# EAGLE design Navitron (EAGLE 9.6.1)
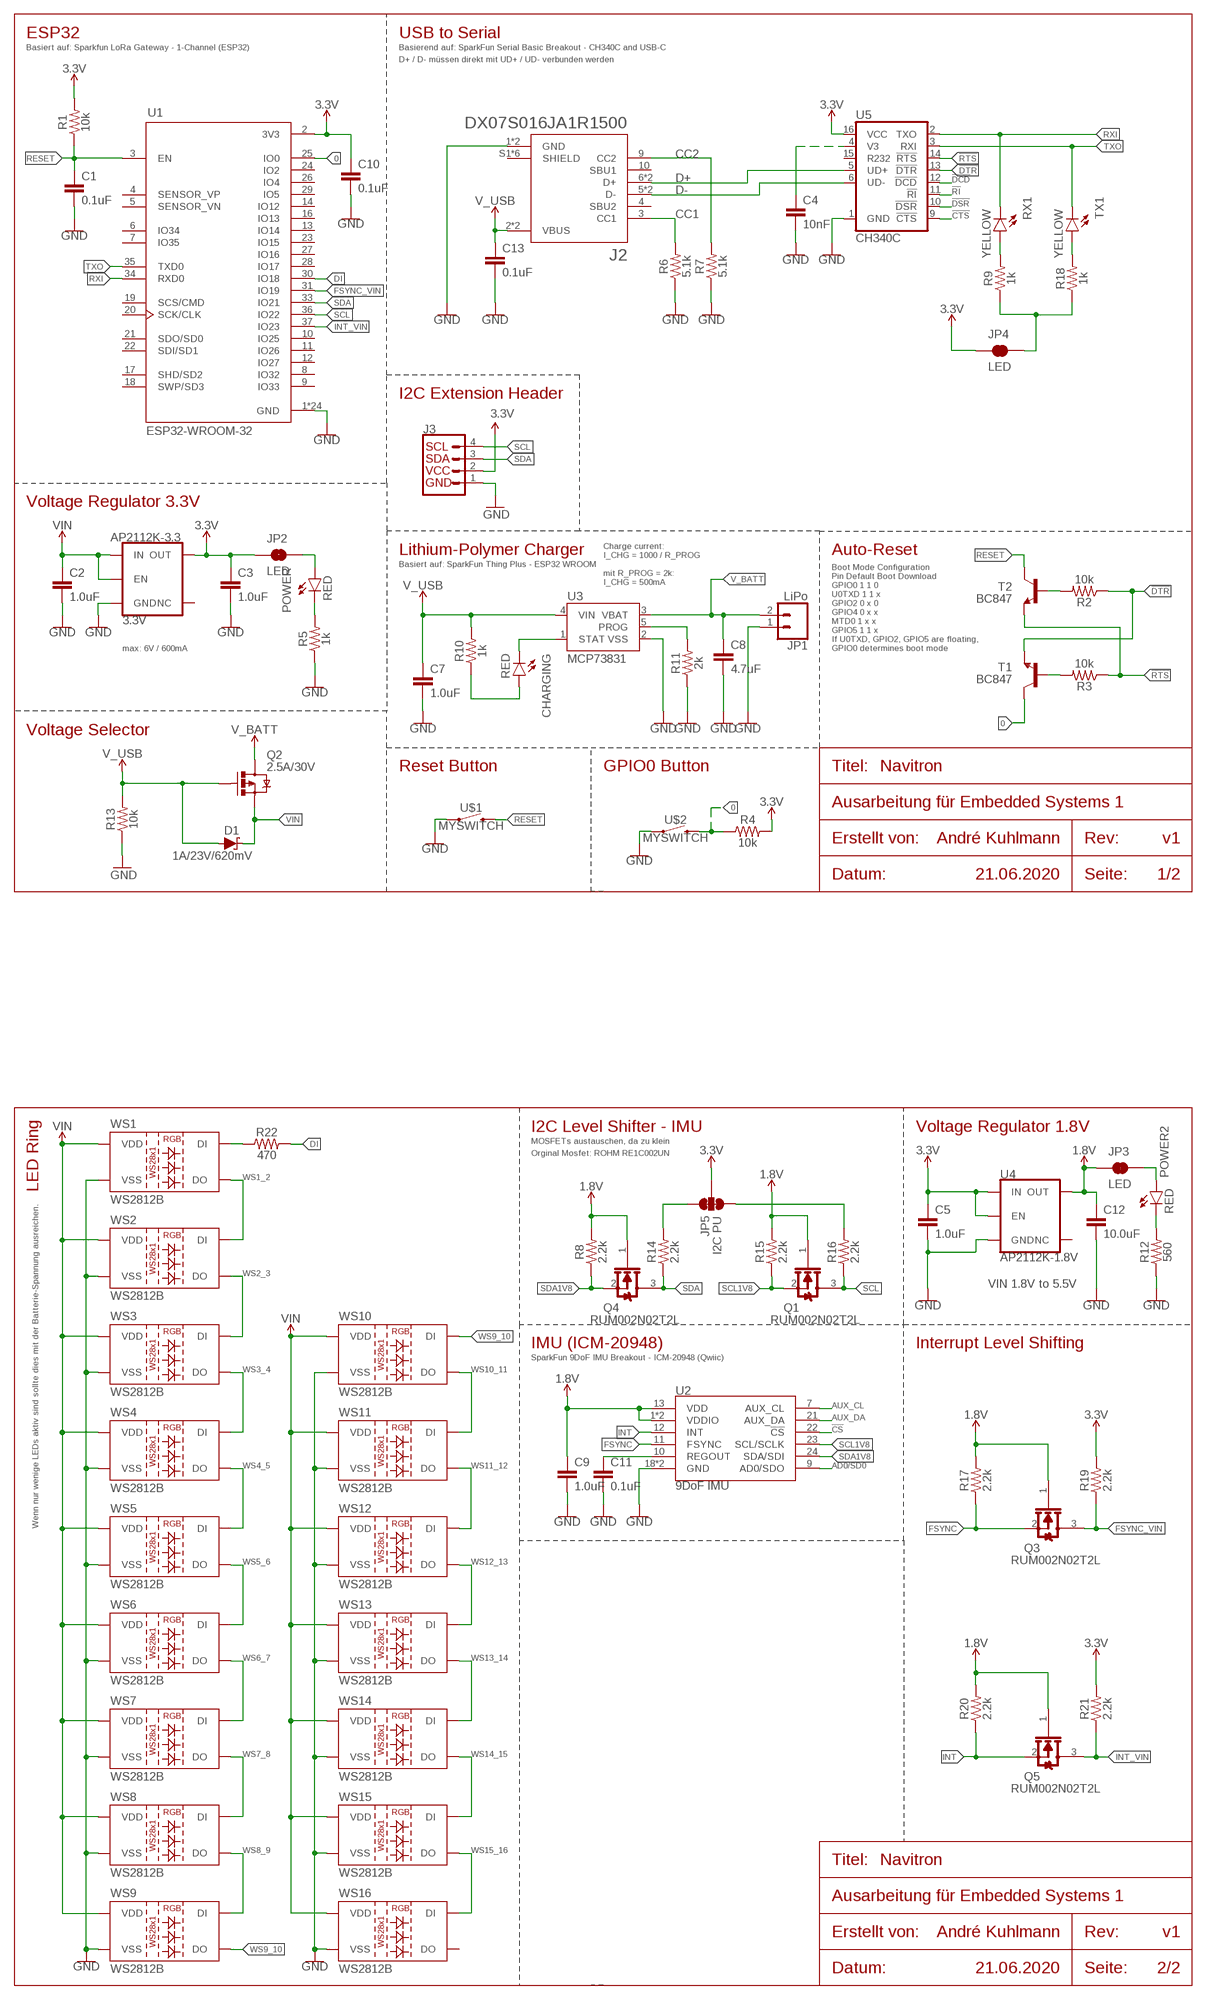
[diagram p0: schematic, sheet 1]

## Parts
AP2112K-3.3  3.3V  V_REG_AP2112K-3.3V  [SOT23-5]
C1  0.1uF  0.1UF-0603-25V-(+80/-20%)  [0603]
C2  1.0uF  0.1UF-0603-25V-(+80/-20%)  [0603]
C3  1.0uF  0.1UF-0603-25V-(+80/-20%)  [0603]
C4  10nF  0.1UF-0603-25V-(+80/-20%)  [0603]
C5  1.0uF  0.1UF-0603-25V-(+80/-20%)  [0603]
C7  1.0uF  0.1UF-0603-25V-(+80/-20%)  [0603]
C8  4.7uF  0.1UF-0603-25V-(+80/-20%)  [0603]
C9  1.0uF  0.1UF-0603-25V-(+80/-20%)  [0603]
C10  0.1uF  0.1UF-0603-25V-(+80/-20%)  [0603]
C11  0.1uF  0.1UF-0603-25V-(+80/-20%)  [0603]
C12  10.0uF  0.1UF-0603-25V-(+80/-20%)  [0603]
C13  0.1uF  0.1UF-0603-25V-(+80/-20%)  [0603]
CHARGING  RED  LED-RED0603  [LED-0603]
D1  1A/23V/620mV  DIODE-SCHOTTKY-BAT20J  [SOD-323]
J2  DX07S016JA1R1500  [JAE_DX07S016JA1R1500]
J3  QWIIC_CONNECTORJS-1MM  [1X04_1MM_RA]
JP1  LiPo  CONN_02-JST-2MM-SMT  [JST-2-SMD]
JP2  LED  JUMPER-SMT_2_NC_TRACE_SILK  [SMT-JUMPER_2_NC_TRACE_SILK]
JP3  LED  JUMPER-SMT_2_NC_TRACE_SILK  [SMT-JUMPER_2_NC_TRACE_SILK]
JP4  LED  JUMPER-SMT_2_NC_TRACE_SILK  [SMT-JUMPER_2_NC_TRACE_SILK]
JP5  I2C PU  JUMPER-SMT_3_2-NC_TRACE_SILK  [SMT-JUMPER_3_2-NC_TRACE_SILK]
POWER  RED  LED-RED0603  [LED-0603]
POWER2  RED  LED-RED0603  [LED-0603]
Q1  ROHM_RUM002N02T2LROHM_RUM002N02T2L_0_0  [ROHM_RUM002N02T2L_0]
Q2  2.5A/30V  MOSFET-PCHANNELDMG2307L  [SOT23-3@1]
Q3  ROHM_RUM002N02T2LROHM_RUM002N02T2L_0_0  [ROHM_RUM002N02T2L_0]
Q4  ROHM_RUM002N02T2LROHM_RUM002N02T2L_0_0  [ROHM_RUM002N02T2L_0]
Q5  ROHM_RUM002N02T2LROHM_RUM002N02T2L_0_0  [ROHM_RUM002N02T2L_0]
R1  10k  10MOHM-0603-1/10W-5%  [0603]
R2  10k  10MOHM-0603-1/10W-5%  [0603]
R3  10k  10MOHM-0603-1/10W-5%  [0603]
R4  10k  10MOHM-0603-1/10W-5%  [0603]
R5  1k  10MOHM-0603-1/10W-5%  [0603]
R6  5.1k  5.1KOHM5.1KOHM-0603-1/10W-1%  [0603]
R7  5.1k  5.1KOHM5.1KOHM-0603-1/10W-1%  [0603]
R8  2.2k  5.1KOHM5.1KOHM-0603-1/10W-1%  [0603]
R9  1k  10MOHM-0603-1/10W-5%  [0603]
R10  1k  5.1KOHM5.1KOHM-0603-1/10W-1%  [0603]
R11  2k  5.1KOHM5.1KOHM-0603-1/10W-1%  [0603]
R12  560  10MOHM-0603-1/10W-5%  [0603]
R13  10k  10MOHM-0603-1/10W-5%  [0603]
R14  2.2k  5.1KOHM5.1KOHM-0603-1/10W-1%  [0603]
R15  2.2k  5.1KOHM5.1KOHM-0603-1/10W-1%  [0603]
R16  2.2k  5.1KOHM5.1KOHM-0603-1/10W-1%  [0603]
R17  2.2k  5.1KOHM5.1KOHM-0603-1/10W-1%  [0603]
R18  1k  10MOHM-0603-1/10W-5%  [0603]
R19  2.2k  5.1KOHM5.1KOHM-0603-1/10W-1%  [0603]
R20  2.2k  5.1KOHM5.1KOHM-0603-1/10W-1%  [0603]
R21  2.2k  5.1KOHM5.1KOHM-0603-1/10W-1%  [0603]
R22  470  5.1KOHM5.1KOHM-0603-1/10W-1%  [0603]
RX1  YELLOW  LED-RED0603  [LED-0603]
T1  BC847  [SOT23]
T2  BC847  [SOT23]
TX1  YELLOW  LED-RED0603  [LED-0603]
U1  ESP32-WROOM-32  [MODULE_ESP32-WROOM-32]
U2  9DoF IMU  MPU-9250  [QFN24-3X3]
U3  MCP73831  [SOT23-5]
U4  AP2112K-1.8V  V_REG_AP2112K-1.8V  [SOT23-5]
U5  CH340C  [SO016]
U$1  MYSWITCH  [MY-BUTTON]
U$2  MYSWITCH  [MY-BUTTON]
WS1  WS2812B  [WS2812B]
WS2  WS2812B  [WS2812B]
WS3  WS2812B  [WS2812B]
WS4  WS2812B  [WS2812B]
WS5  WS2812B  [WS2812B]
WS6  WS2812B  [WS2812B]
WS7  WS2812B  [WS2812B]
WS8  WS2812B  [WS2812B]
WS9  WS2812B  [WS2812B]
WS10  WS2812B  [WS2812B]
WS11  WS2812B  [WS2812B]
WS12  WS2812B  [WS2812B]
WS13  WS2812B  [WS2812B]
WS14  WS2812B  [WS2812B]
WS15  WS2812B  [WS2812B]
WS16  WS2812B  [WS2812B]

## Nets
0: R4.1 T1.3(C) U1.25(IO0) U$2.P$2
1.8V: C9.1 C12.1 JP3.1 Q1.1(GATE) Q3.1(GATE) Q4.1(GATE) Q5.1(GATE) R8.2 R15.2 R17.2 R20.2 U2.1(VDDIO) U2.8(VDDIO) U2.13(VDD) U4.5(OUT)
3.3V: AP2112K-3.3.5(OUT) C3.1 C5.1 C10.1 J3.2 JP2.1 JP4.1 JP5.2 R1.2 R4.2 R19.2 R21.2 U1.2(3V3) U4.1(IN) U4.3(EN) U5.16(VCC)
!CS: U2.22(!CS)
!CTS: U5.9(!CTS)
!DCD: U5.12(!DCD)
!DSR: U5.10(!DSR)
!DTR: R2.1 T1.2(E) U5.13(!DTR)
!RI: U5.11(!RI)
!RTS: R3.1 T2.2(E) U5.14(!RTS)
AD0/SD0: U2.9(AD0/SDO)
AUX_CL: U2.7(AUX_CL)
AUX_DA: U2.21(AUX_DA)
CC1: J2.3(CC1) R6.2
CC2: J2.9(CC2) R7.2
CHAR_LED_VIN: CHARGING.A R10.1
D+: J2.6(D+) J2.7(D+) U5.5(UD+)
D-: J2.5(D-) J2.8(D-) U5.6(UD-)
DI: R22.2 U1.30(IO18)
DI_TO_WS: R22.1 WS1.4(DI)
FSYNC: Q3.2(SOURCE) R17.1 U2.11(FSYNC)
FSYNC_VIN: Q3.3(DRAIN) R19.1 U1.31(IO19)
GND: AP2112K-3.3.2(GND) C1.2 C2.2 C3.2 C4.2 C5.2 C7.2 C8.2 C9.2 C10.2 C11.2 C12.2 C13.2 J2.1(GND) J2.12(GND) J3.1 JP1.1 R5.1 R6.1 R7.1 R11.1 R12.1 R13.1 U1.1(GND) U1.15(GND) U1.38(GND) U1.39_1(GND) U1.39_2(GND) U1.39_3(GND) U1.39_4(GND) U1.39_5(GND) U1.39_6(GND) U1.39_7(GND) U1.39_8(GND) U1.39_9(GND) U1.39_10(GND) U1.39_11(GND) U1.39_12(GND) U1.39_13(GND) U1.39_14(GND) U1.39_15(GND) U1.39_16(GND) U1.39_17(GND) U1.39_18(GND) U1.39_19(GND) U1.39_20(GND) U1.39_21(GND) U2.18(GND) U2.20(GND) U3.2(VSS) U4.2(GND) U5.1(GND) U$1.P$1 U$2.P$1 WS1.3(VSS) WS2.3(VSS) WS3.3(VSS) WS4.3(VSS) WS5.3(VSS) WS6.3(VSS) WS7.3(VSS) WS8.3(VSS) WS9.3(VSS) WS10.3(VSS) WS11.3(VSS) WS12.3(VSS) WS13.3(VSS) WS14.3(VSS) WS15.3(VSS) WS16.3(VSS)
INT: Q5.2(SOURCE) R20.1 U2.12(INT)
INT_VIN: Q5.3(DRAIN) R21.1 U1.37(IO23)
LED1.8: JP3.2 POWER2.A
LED1.8_2: POWER2.C R12.2
N$1: POWER.C R5.2
N$8: JP2.2 POWER.A
PROG: R11.2 U3.5(PROG)
REGOUT: C11.1 U2.10(REGOUT)
RESET: C1.1 R1.1 T2.3(C) U1.3(EN) U$1.P$2
RXI: RX1.C U1.34(RXD0) U5.2(TXO)
SCL: J3.4 Q1.3(DRAIN) R16.1 U1.36(IO22)
SCL1V8: Q1.2(SOURCE) R15.1 U2.23(SCL/SCLK)
SDA: J3.3 Q4.3(DRAIN) R14.1 U1.33(IO21)
SDA1V8: Q4.2(SOURCE) R8.1 U2.24(SDA/SDI)
SDA_W_1: JP5.1 R14.2
SDA_W_2: JP5.3 R16.2
STAT: CHARGING.C U3.1(STAT)
TO_RX_LED: R9.2 RX1.A
TO_T1: R3.2 T1.1(B)
TO_T2: R2.2 T2.1(B)
TO_TX_LED: R18.2 TX1.A
TX_RX_LED_SUPPLY: JP4.2 R9.1 R18.1
TXO: TX1.C U1.35(TXD0) U5.3(RXI)
V3_CH340: C4.1 U5.4(V3)
V_BATT: C8.1 JP1.2 Q2.3(D) U3.3(VBAT)
V_USB: C7.1 C13.1 D1.A J2.2(VBUS) J2.11(VBUS) Q2.1(G) R10.2 R13.2 U3.4(VIN)
VIN: AP2112K-3.3.1(IN) AP2112K-3.3.3(EN) C2.1 D1.C Q2.2(S) WS1.1(VDD) WS2.1(VDD) WS3.1(VDD) WS4.1(VDD) WS5.1(VDD) WS6.1(VDD) WS7.1(VDD) WS8.1(VDD) WS9.1(VDD) WS10.1(VDD) WS11.1(VDD) WS12.1(VDD) WS13.1(VDD) WS14.1(VDD) WS15.1(VDD) WS16.1(VDD)
WS1_2: WS1.2(DO) WS2.4(DI)
WS2_3: WS2.2(DO) WS3.4(DI)
WS3_4: WS3.2(DO) WS4.4(DI)
WS4_5: WS4.2(DO) WS5.4(DI)
WS5_6: WS5.2(DO) WS6.4(DI)
WS6_7: WS6.2(DO) WS7.4(DI)
WS7_8: WS7.2(DO) WS8.4(DI)
WS8_9: WS8.2(DO) WS9.4(DI)
WS9_10: WS9.2(DO) WS10.4(DI)
WS10_11: WS10.2(DO) WS11.4(DI)
WS11_12: WS11.2(DO) WS12.4(DI)
WS12_13: WS12.2(DO) WS13.4(DI)
WS13_14: WS13.2(DO) WS14.4(DI)
WS14_15: WS14.2(DO) WS15.4(DI)
WS15_16: WS15.2(DO) WS16.4(DI)
Unconnected: AP2112K-3.3.4(NC) J2.4(SBU2) J2.10(SBU1) J2.S1(SHIELD) J2.S2(SHIELD) J2.S3(SHIELD) J2.S4(SHIELD) J2.S5(SHIELD) J2.S6(SHIELD) U1.4(SENSOR_VP) U1.5(SENSOR_VN) U1.6(IO34) U1.7(IO35) U1.8(IO32) U1.9(IO33) U1.10(IO25) U1.11(IO26) U1.12(IO27) U1.13(IO14) U1.14(IO12) U1.16(IO13) U1.17(SHD/SD2) U1.18(SWP/SD3) U1.19(SCS/CMD) U1.20(SCK/CLK) U1.21(SDO/SD0) U1.22(SDI/SD1) U1.23(IO15) U1.24(IO2) U1.26(IO4) U1.27(IO16) U1.28(IO17) U1.29(IO5) U4.4(NC) U5.15(R232) WS16.2(DO)

## Notes on the sheet
- ESP32 | USB to Serial
- Basiert auf: Sparkfun LoRa Gateway - 1-Channel (ESP32) | Basierend auf: SparkFun Serial Basic Breakout - CH340C and USB-C
- D+ / D- müssen direkt mit UD+ / UD- verbunden werden
- I2C Extension Header
- Voltage Regulator 3.3V
- Charge current:
  I_CHG = 1000 / R_PROG
  
  mit R_PROG = 2k:
  I_CHG = 500mA
- Lithium-Polymer Charger | Auto-Reset
- Basiert auf: SparkFun Thing Plus - ESP32 WROOM
- max: 6V / 600mA
- Boot Mode Configuration
  Pin Default Boot Download
  GPIO0 1 1 0
  U0TXD 1 1 x
  GPIO2 0 x 0
  GPIO4 0 x x
  MTD0 1 x x
  GPIO5 1 1 x
  If U0TXD, GPIO2, GPIO5 are floating,
  GPIO0 determines boot mode
- Voltage Selector
- Reset Button | GPIO0 Button | Titel: | Navitron
- Ausarbeitung für Embedded Systems 1
- Erstellt von: | André Kuhlmann | Rev: | v1
- Datum: | 21.06.2020 | Seite: | 1/2
- LED Ring | I2C Level Shifter - IMU | Voltage Regulator 1.8V
- MOSFETs austauschen, da zu klein
- Orginal Mosfet: ROHM RE1C002UN
- Wenn nur wenige LEDs aktiv sind sollte dies mit der Batterie-Spannung ausreichen.
- VIN 1.8V to 5.5V
- IMU (ICM-20948) | Interrupt Level Shifting
- SparkFun 9DoF IMU Breakout - ICM-20948 (Qwiic)
- Titel: | Navitron
- Ausarbeitung für Embedded Systems 1
- Erstellt von: | André Kuhlmann | Rev: | v1
- Datum: | 21.06.2020 | Seite: | 2/2

## Library data of the parts
AP2112K-3.3 = SparkFun-IC-Power:V_REG_AP2112: AP2112 - 600mA CMOS LDO Regulator w/ Enable The AP2112 is CMOS process low dropout linear regulator with enable function, the regulator delivers a guaranteed 600mA (min.) continuous load current. Features Output Voltage Accuracy: ±1.5% Output Current: 600mA (Min.) Foldback Short Current Protection: 50mA Enable Function to Turn ON/OFF VOUT Low Dropout Voltage (3.3V): 250mV (Typ.) @IOUT=600mA Excellent Load Regulation: 0.2%/A (Typ.) Excellent Line Regulation: 0.02%/V (Typ.) Low Quiescent Current: 55μA (Typ.) Low Standby Current: 0.01μA (Typ.) Low Output Noise: 50μVRMS PSRR: 100Hz -65dB, 1kHz -65dB OTSD Protection Stable with 1.0μF Flexible Cap: Ceramic, Tantalum and Aluminum Electrolytic Operation Temperature Range: -40°C to 85°C ESD: MM 400V, HBM 4000V; PROD_ID: VREG-12457
C1 C10 C11 C13 = SparkFun-Capacitors:0.1UF: 0.1µF ceramic capacitors A capacitor is a passive two-terminal electrical component used to store electrical energy temporarily in an electric field.; PROD_ID: CAP-00810
C2-C5 C7-C9 C12 = SparkFun-Capacitors:0.1UF: 0.1µF ceramic capacitors A capacitor is a passive two-terminal electrical component used to store electrical energy temporarily in an electric field.; PROD_ID: CAP-00810; VALUE: 0.1uF
CHARGING POWER POWER2 = SparkFun-LED:LED-RED: Red SMD LED Used in manufacturing of most products at SparkFun Packages: 0603 - SMD 0603 package [Product Link] <http://docs.avagotech.com/docs/AV02-0551EN> 0603 SMART - SMD 0603 SMART package ( more efficient and expensive)[Product Link] <http://www.osram-os.com/Graphics/XPic2/00077099_0.pdf> 1206 - SMD1206 package [Product Link] <https://www.sparkfun.com/datasheets/DevTools/LilyPad/Q150OVS4.pdff> SparkFun Products: Pro Mini 328 -5V <https://www.sparkfun.com/products/821> RedBoard <https://www.sparkfun.com/products/12757> IOIO-OTG <https://www.sparkfun.com/products/13613>; PROD_ID: DIO-00819
D1 = SparkFun-DiscreteSemi:DIODE-SCHOTTKY: Schottky diode A Schottky diode is a semiconductor diode which has a low forward voltage drop and a very fast switching action.; PROD_ID: DIO-11623
J2 = USB Type C - DX07S016JA1R1500:DX07S016JA1R1500: USB-C (USB TYPE-C) USB 2.0 Receptacle Connector 24 (16+8 Dummy) Position Surface Mount, Right Angle; Through Hole; DESCRIPTION: USB-C (USB TYPE-C) USB 2.0 Receptacle Connector 24 (16+8 Dummy) Position Surface Mount, Right Angle; Through Hole; DIGI-KEY_PART_NUMBER: 670-DX07S016JA1R1500CT-ND; DIGIKEY-PURCHASE-URL: https://snapeda.com/shop?store=DigiKey&id=4551013; MF: JAE Electronics; MOUSER-PURCHASE-URL: https://snapeda.com/shop?store=Mouser&id=4551013; MP: DX07S016JA1R1500; PACKAGE: None
J3 = SparkFun-Connectors:QWIIC_CONNECTOR: SparkFun I2C Standard Qwiic Connector An SMD 1mm pitch JST connector makes it easy and quick (get it? Qwiic?) to connect I2C devices to each other. The Qwiic system <http://www.sparkfun.com/qwiic> enables fast and solderless connection between popular platforms and various sensors and actuators. We carry 200mm <https://www.sparkfun.com/products/14204>, 100mm <https://www.sparkfun.com/products/14205>, 50mm <https://www.sparkfun.com/products/14206>, and breadboard friendly <https://www.sparkfun.com/products/14207> Qwiic cables. We also offer 10 pcs strips <https://www.sparkfun.com/products/14323> the SMD connectors.; PROD_ID: CONN-13694
JP1 = SparkFun-Connectors:CONN_02: Multi connection point. Often used as Generic Header-pin footprint for 0.1 inch spaced/style header connections On any of the 0.1 inch spaced packages, you can populate with these: Break Away Headers - Straight <https://www.sparkfun.com/products/116> (PRT-00116) Break Away Male Headers - Right Angle <https://www.sparkfun.com/products/553> (PRT-00553) Female Headers <https://www.sparkfun.com/products/115> (PRT-00115) Break Away Headers - Machine Pin <https://www.sparkfun.com/products/117> (PRT-00117) Break Away Female Headers - Swiss Machine Pin <https://www.sparkfun.com/products/743> (PRT-00743) For SCREWTERMINALS and SPRING TERMINALS visit here: Screw Terimnals on SparkFun.com <https://www.sparkfun.com/search/results?term=Screw+Terminals> (5mm/3.5mm/2.54mm spacing) This device is also useful as a general connection point to wire up your design to another part of your project. Our various solder wires solder well into these plated through hole pads. Hook-Up Wire - Assortment (Stranded, 22 AWG) <https://www.sparkfun.com/products/11375> (PRT-11375) Hook-Up Wire - Assortment (Solid Core, 22 AWG) <https://www.sparkfun.com/products/11367> (PRT-11367) View the entire wire category on our website here <https://www.sparkfun.com/categories/141> Special notes: Molex polarized connector foot print use with: PRT-08233 with associated crimp pins and housings. 2.54_SCREWTERM for use with PRT-10571. 3.5mm Screw Terminal footprints for PRT-08084 5mm Screw Terminal footprints for use with PRT-08432; PROD_ID: CONN-11443
JP2-JP4 = SparkFun-Jumpers:JUMPER-SMT_2_NC_TRACE: Normally closed trace jumper This jumper has a trace between two pads so it's normally closed (NC). Use a razor knife to open the connection. For best results follow the IPC guidelines for cutting traces: Cutout at least 0.063 mm (0.005 in). Remove all loose material to clean up the cut area. Seal the cut with an approved epoxy. Reapply solder to reclose the connection.
JP5 = SparkFun-Jumpers:JUMPER-SMT_3_2-NC_TRACE: Normally closed trace jumper (2 of 2 connections) This jumper has a trace between all three pads so they are normally closed (NC). Use a razor knife to open the connection(s). For best results follow the IPC guidelines for cutting traces: Cutout at least 0.063 mm (0.005 in). Remove all loose material to clean up the cut area. Seal the cut with an approved epoxy. Reapply solder to reclose the connection(s).
Q1 Q3-Q5 = ROHM - RUM002N02T2L:ROHM_RUM002N02T2L: Nch 20V 200mA Small Signal MOSFET; CENTROID_NOT_SPECIFIED: No; DATASHEET: http://www.rohm.com/web/global/datasheet/RUM002N02/rum002n02t2l-e; DIGIKEY_DESCRIPTION: TRANS MOSFET N-CH 20V 0.2A VMT3; DIGIKEY_PART_NUMBER: RUM002N02T2LCT-ND; IMPORTED_FROM: octopart; IPC_LAND_PATTERN_NAME: SOT95P280X160-3; LEAD_FREE: yes; MF: ROHM; MOUSER_PART_NUMBER: 755-RUM002N02T2L; MPN: RUM002N02T2L; PACKAGE: SOT-23; PREFIX: Q; ROHS: yes; TEMPERATURE_RANGE_HIGH: +150°C; TEMPERATURE_RANGE_LOW: -55°C
Q2 = SparkFun-DiscreteSemi:MOSFET-PCHANNEL: Generic PMOSFET IRLML2244 - TRANS-11153 (SOT-23 -20V -4.3A) (1.Gate 2.Source 3.Drain) FQP27P06 - COM-10349 <http://www.sparkfun.com/products/10349> (TO-220 -60V -27A) (1.Gate 2.Source 3.Drain); PROD_ID: TRANS-11308
R1-R5 R9 R12 R13 R18 = SparkFun-Resistors:10MOHM: RES-09327; PROD_ID: RES-08283; VALUE: 10M
R6 R7 = SparkFun-Resistors:5.1KOHM; PROD_ID: RES-12083
R8 R10 R11 R14-R17 R19-R22 = SparkFun-Resistors:5.1KOHM; PROD_ID: RES-12083; VALUE: 5.1k
RX1 TX1 = SparkFun-LED:LED-RED: Red SMD LED Used in manufacturing of most products at SparkFun Packages: 0603 - SMD 0603 package [Product Link] <http://docs.avagotech.com/docs/AV02-0551EN> 0603 SMART - SMD 0603 SMART package ( more efficient and expensive)[Product Link] <http://www.osram-os.com/Graphics/XPic2/00077099_0.pdf> 1206 - SMD1206 package [Product Link] <https://www.sparkfun.com/datasheets/DevTools/LilyPad/Q150OVS4.pdff> SparkFun Products: Pro Mini 328 -5V <https://www.sparkfun.com/products/821> RedBoard <https://www.sparkfun.com/products/12757> IOIO-OTG <https://www.sparkfun.com/products/13613>; PROD_ID: DIO-00819; VALUE: RED
T1 T2 = transistor:BC847: NPN TRANSISTOR
U1 = ESP32-WROOM-32:ESP32-WROOM-32: Bluetooth, WiFi Transceiver Module 2.4GHz ~ 2.5GHz Surface Mount; AVAILABILITY: Unavailable; DESCRIPTION: Bluetooth, WiFi Transceiver Module 2.4GHz ~ 2.5GHz Surface Mount; DIGIKEY-PURCHASE-URL: https://snapeda.com/shop?store=DigiKey&id=2753322; MF: Espressif Systems; MP: ESP32-WROOM-32; PACKAGE: Module Espressif Systems; PRICE: None
U2 = SparkFun-Sensors:MPU-9250: MPU-9250 9 Degree of Freedom IMU System in Package that contains MPU-6500 & AK8963 NC pin 19. 2-6 & 14-17 not internally connected. May be used for PCB trace routing. Datasheet <https://cdn.sparkfun.com/assets/learn_tutorials/5/5/0/MPU9250REV1.0.pdf> SparkFun Products: SparkFun 9DoF Razor IMU M0 <https://www.sparkfun.com/products/14001> SparkFun IMU Breakout - MPU-9250 <https://www.sparkfun.com/products/13762>; PROD_ID: IC-13192
U3 = SparkFun-PowerIC:MCP73831: Miniature single cell, fully integrated Li-Ion, Li-polymer charge management controller http://ww1.microchip.com/downloads/en/DeviceDoc/20001984g.pdf IC-09995; PROD_ID: IC-09995
U4 = SparkFun-IC-Power-Customized:V_REG_AP2112: AP2112 - 600mA CMOS LDO Regulator w/ Enable The AP2112 is CMOS process low dropout linear regulator with enable function, the regulator delivers a guaranteed 600mA (min.) continuous load current. Features Output Voltage Accuracy: ±1.5% Output Current: 600mA (Min.) Foldback Short Current Protection: 50mA Enable Function to Turn ON/OFF VOUT Low Dropout Voltage (3.3V): 250mV (Typ.) @IOUT=600mA Excellent Load Regulation: 0.2%/A (Typ.) Excellent Line Regulation: 0.02%/V (Typ.) Low Quiescent Current: 55μA (Typ.) Low Standby Current: 0.01μA (Typ.) Low Output Noise: 50μVRMS PSRR: 100Hz -65dB, 1kHz -65dB OTSD Protection Stable with 1.0μF Flexible Cap: Ceramic, Tantalum and Aluminum Electrolytic Operation Temperature Range: -40°C to 85°C ESD: MM 400V, HBM 4000V
U5 = SparkFun-IC-Comms:CH340C; PROD_ID: IC-14038
U$1 U$2 = MyLib:MYSWITCH
WS1-WS16 = SparkFun-LED:WS2812B: WS2812B SMD addressable RGB LED 5x5mm SMD LED with built-in controller IC. Color: Red/Green/Blue mC Rating: RGB: 390, 660, 180 mcd Forward Voltage: RGB: 2.0, 3.0, 3.0 V Packages:WS2812B SparkFun Products: Blynk Board - ESP8266 <https://www.sparkfun.com/products/13794>; PROD_ID: DIO-12503

## Net classes
1 power: width 0.178 mm

## Board
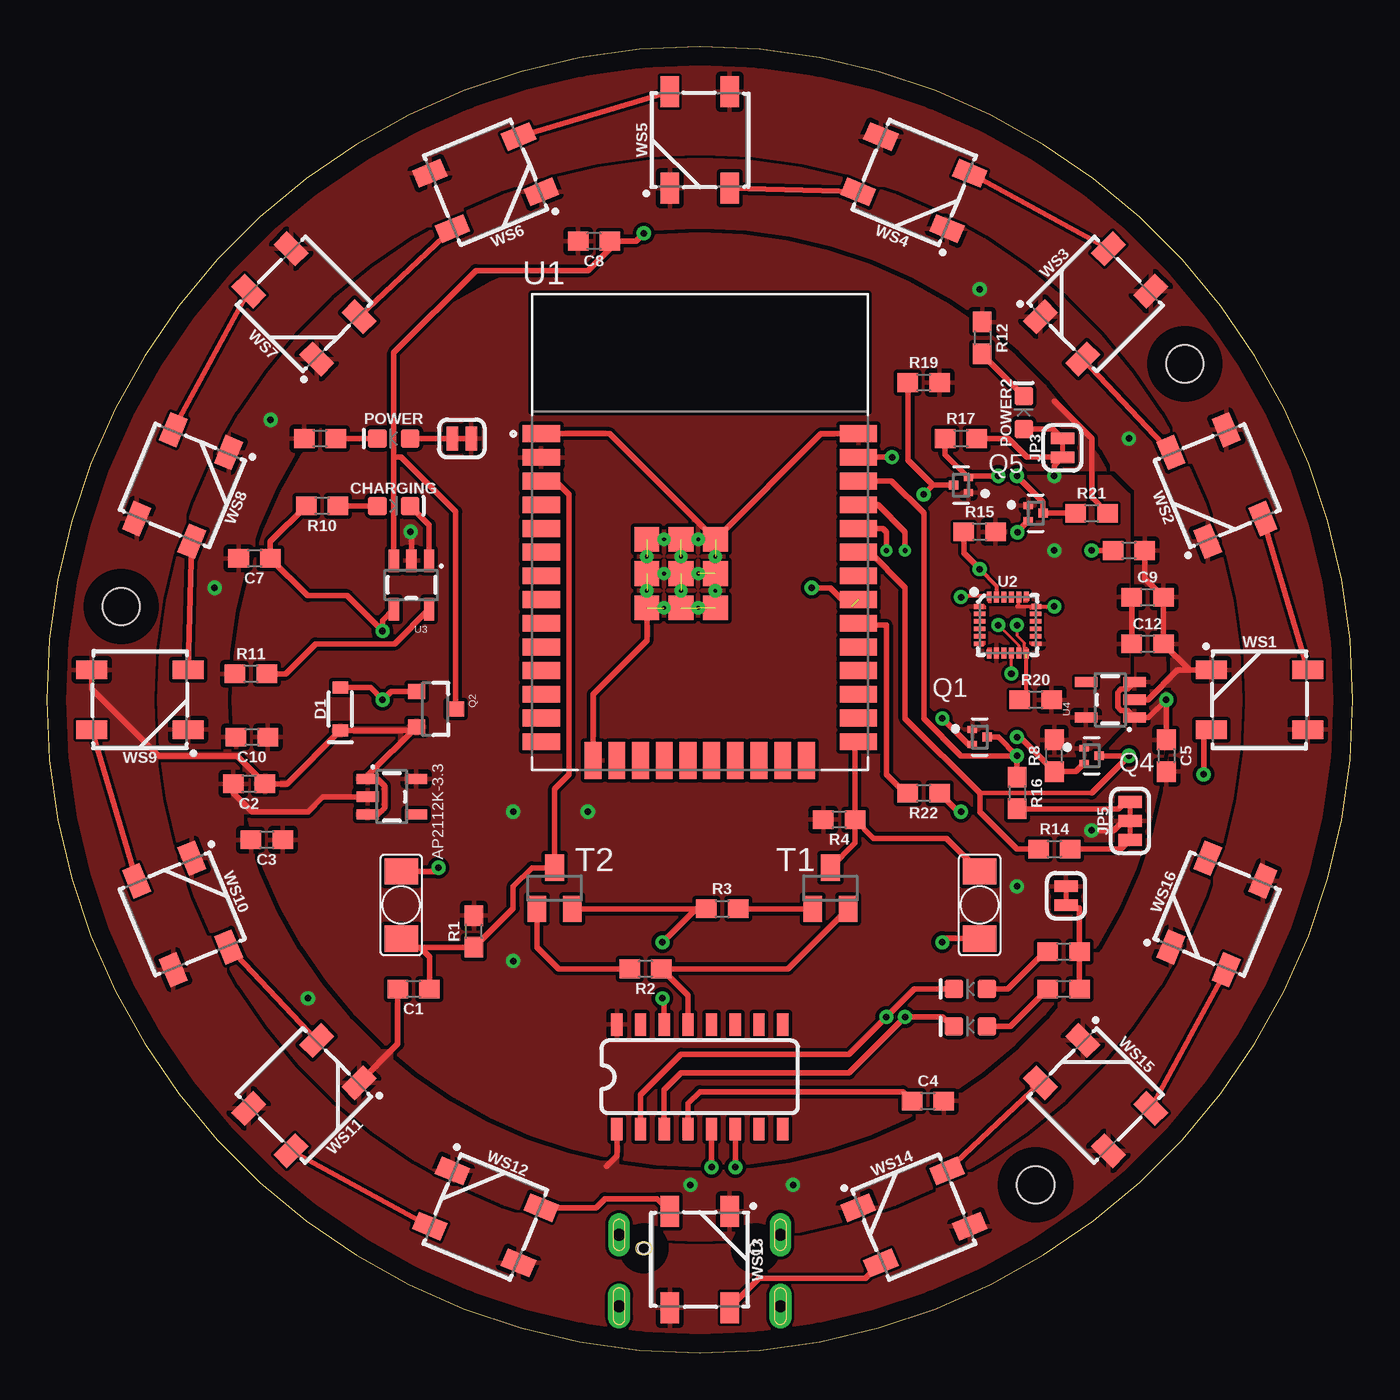
[diagram p1: board, top side]
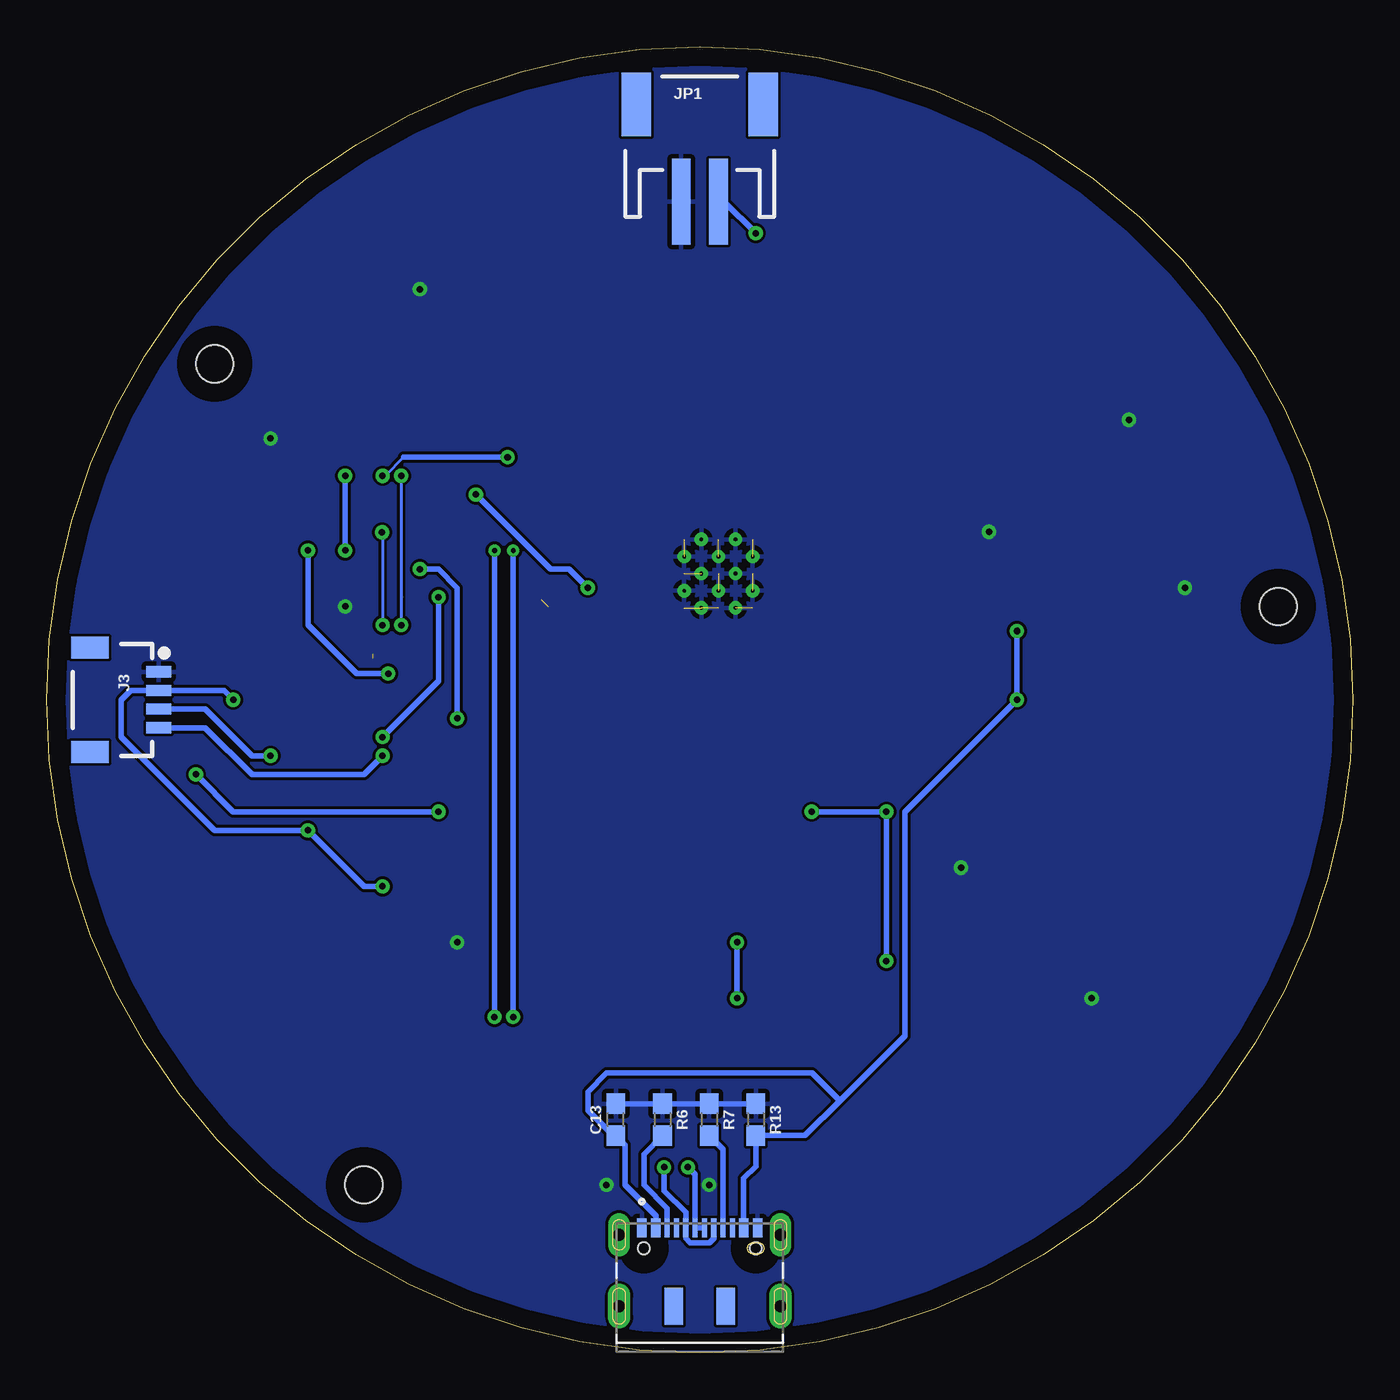
[diagram p2: board, bottom side, seen from below]

Size 70 x 70 mm. Coordinates in mm from the lower left corner, seen from the top.
Outline: 0,35 arc90 35,0 arc90 70,35 arc90 35,70
Outline: 35,70 arc90 0,35
Outline: 35,70 arc90 0,35
Copper layers (1*16): Top 0.035mm / dielectric 0.15mm / Bottom 0.035mm
Design rules "default": minimum track width 6mil, minimum drill 0.35mm, track to track 6mil, track to pad 6mil, pad to pad 6mil, via to via 6mil, smd to smd 6mil, copper to edge 40mil, drill to drill 6mil, minimum pad ring 10mil, minimum via ring 8mil, stop-mask expansion 4mil, vias tented up to drill 0mil, thermal gap 10mil
Holes 2 mm at 4,40 61,53 53,9

### Footprints (pad centres in the part's own frame; a part is rotated, then mirrored left to right if it is on the bottom)
SOT23-5 = smd 0.55 x 1.2: 1 -0.95,-1.3; 2 0,-1.3; 3 0.95,-1.3; 4 0.95,1.3; 5 -0.95,1.3
0603 = smd 1.1 x 1: 1 -0.85,0; 2 0.85,0
LED-0603 = smd 1 x 1: A -0.877,0; C 0.877,0
SOD-323 = smd 0.63 x 0.83: A 1.15,0; C -1.15,0
JAE_DX07S016JA1R1500 = smd 0.52 x 1: 1 -3.1,1.1; 2 -2.35,1.1; 11 2.35,1.1; 12 3.1,1.1 | smd 0.27 x 1: 3 -1.75,1.1; 4 -1.25,1.1; 5 -0.75,1.1; 6 -0.25,1.1; 7 0.25,1.1; 8 0.75,1.1; 9 1.25,1.1; 10 1.75,1.1 | smd 1 x 2: S1 -1.4,-3.1; S2 1.4,-3.1 | drill 0.65 long: S3 -4.32,0.725; S4 4.32,0.725 | drill 0.65 pad 1.2 long: S5 -4.32,-3.1; S6 4.32,-3.1 | hole 0.6: 3,0 | hole 0.63: 3,0; -3,0
1X04_1MM_RA = smd 0.6 x 1.35: 1 -1.5,0; 2 -0.5,0; 3 0.5,0; 4 1.5,0 | smd 1.2 x 2: NC1 2.8,-3.675; NC2 -2.8,-3.675
JST-2-SMD = smd 1 x 4.6: 1 -1,-3.7; 2 1,-3.7 | smd 1.6 x 3.4: NC1 -3.4,1.5; NC2 3.4,1.5
SMT-JUMPER_2_NC_TRACE_SILK = smd 0.635 x 1.27: 1 -0.508,0; 2 0.508,0
SMT-JUMPER_3_2-NC_TRACE_SILK = smd 0.635 x 1.27: 1 -1.016,0; 2 0,0; 3 1.016,0
ROHM_RUM002N02T2L_0 = smd 0.5 x 0.37: 1 -0.4,0.4; 2 -0.4,-0.4 | smd 0.5 x 0.47: 3 0.4,0
SOT23-3@1 = smd 0.8 x 0.9: 1 -0.95,-1; 2 0.95,-1; 3 0,1.1
SOT23 = smd 1 x 1.4: 1 -0.95,-1.1; 2 0.95,-1.1; 3 0,1.1
MODULE_ESP32-WROOM-32 = smd 2 x 0.9: 1 -8.5,5.26; 2 -8.5,3.99; 3 -8.5,2.72; 4 -8.5,1.45; 5 -8.5,0.18; 6 -8.5,-1.09; 7 -8.5,-2.36; 8 -8.5,-3.63; 9 -8.5,-4.9; 10 -8.5,-6.17; 11 -8.5,-7.44; 12 -8.5,-8.71; 13 -8.5,-9.98; 14 -8.5,-11.25; 25 8.5,-11.25; 26 8.5,-9.98; 27 8.5,-8.71; 28 8.5,-7.44; 29 8.5,-6.17; 30 8.5,-4.9; 31 8.5,-3.63; 32 8.5,-2.36; 33 8.5,-1.09; 34 8.5,0.18; 35 8.5,1.45; 36 8.5,2.72; 37 8.5,3.99; 38 8.5,5.26 | smd 0.9 x 2: 15 -5.715,-12.25; 16 -4.445,-12.25; 17 -3.175,-12.25; 18 -1.905,-12.25; 19 -0.635,-12.25; 20 0.635,-12.25; 21 1.905,-12.25; 22 3.175,-12.25; 23 4.445,-12.25; 24 5.715,-12.25 | smd 1.33 x 1.33: 39_1 -2.835,-0.405; 39_2 -1,-0.405; 39_3 0.835,-0.405; 39_4 -2.835,-2.24; 39_5 -1,-2.24; 39_6 0.835,-2.24; 39_7 -2.835,-4.075; 39_8 -1,-4.075; 39_9 0.835,-4.075 | drill 0.2 pad 0.3: 39_10 -1.917,-0.405; 39_11 -0.083,-0.405; 39_12 -2.835,-1.323; 39_13 -1,-1.323; 39_14 0.835,-1.323; 39_15 -1.917,-2.24; 39_16 -0.083,-2.24; 39_17 -2.835,-3.158; 39_18 -1,-3.158; 39_19 0.835,-3.158; 39_20 -1.917,-4.075; 39_21 -0.083,-4.075
QFN24-3X3 = smd 0.495 x 0.25: 1 -1.552,1; 6 -1.552,-1; 13 1.552,-1; 18 1.552,1 | smd 0.6 x 0.25: 2 -1.5,0.6; 3 -1.5,0.2; 4 -1.5,-0.2; 5 -1.5,-0.6; 14 1.5,-0.6; 15 1.5,-0.2; 16 1.5,0.2; 17 1.5,0.6 | smd 0.25 x 0.495: 7 -1,-1.552; 12 1,-1.552; 19 1,1.552; 24 -1,1.552 | smd 0.25 x 0.6: 8 -0.6,-1.5; 9 -0.2,-1.5; 10 0.2,-1.5; 11 0.6,-1.5; 20 0.6,1.5; 21 0.2,1.5; 22 -0.2,1.5; 23 -0.6,1.5
SO016 = smd 0.6 x 1.2: 1 -4.445,-2.8; 2 -3.175,-2.8; 3 -1.905,-2.8; 4 -0.635,-2.8; 5 0.635,-2.8; 6 1.905,-2.8; 7 3.175,-2.8; 8 4.445,-2.8; 9 4.445,2.8; 10 3.175,2.8; 11 1.905,2.8; 12 0.635,2.8; 13 -0.635,2.8; 14 -1.905,2.8; 15 -3.175,2.8; 16 -4.445,2.8
MY-BUTTON = smd 1.4 x 1.8: P$1 -1.8,0; P$2 1.8,0
WS2812B = smd 1.651 x 1: 1 2.577,-1.6; 2 2.577,1.6; 3 -2.577,1.6; 4 -2.577,-1.6

### Placement (x,y rotation side)
AP2112K-3.3  18.5,29.8 270 top
C1  19.66,19.5 180 top
C2  10.85,30.5 180 top
C3  11.8,27.5 180 top
C4  47.23,13.5 0 top
C5  60,32 270 top
C7  11.14,42.58 180 top
C8  29.33,59.58 180 top
C9  59,40.5 0 top
C10  11,33 180 top
C11  58,43 0 top
C12  59,38 0 top
C13  39.5,12.5 90 bottom
CHARGING  18.6,45.39 0 top
D1  15.74,34.5 90 top
J2  35,5.6 0 bottom
J3  64,35 270 bottom
JP1  35,65.4 0 bottom
JP2  22.25,49 180 top
JP3  54.44,48.5 90 top
JP4  54.63,24.5 270 top
JP5  58.06,28.5 90 top
POWER  18.6,49 180 top
POWER2  52.36,50.39 90 top
Q1  50,33 0 top
Q2  20.82,34.5 270 top
Q3  49,46.5 180 top
Q4  56,32 0 top
Q5  53,45 0 top
R1  22.9,22.58 90 top
R2  32.09,20.58 180 top
R3  36.2,23.8 0 top
R4  42.47,28.58 180 top
R5  14.66,49 0 top
R6  37,12.5 270 bottom
R7  34.5,12.5 270 bottom
R8  54,32 90 top
R9  54.5,21.5 180 top
R10  14.76,45.39 180 top
R11  10.95,36.39 0 top
R12  50.14,54.39 270 top
R13  32,12.5 270 bottom
R14  54,27 0 top
R15  50,44 0 top
R16  52,30 270 top
R17  49,49 0 top
R18  54.5,19.5 180 top
R19  47,52 0 top
R20  53,35 0 top
R21  56,45 0 top
R22  47,30 180 top
RX1  49.5,19.5 180 top
T1  42,24.9 0 top
T2  27.22,24.9 0 top
TX1  49.5,17.5 180 top
U1  35,44 0 top
U2  51.5,39 0 top
U3  19.55,41.15 180 top
U4  57,35 90 top
U5  35,14.8 0 top
U$1  19,24 270 top
U$2  50,24 90 top
WS1  65,35 0 top
WS2  62.72,46.48 112.5 top
WS3  56.21,56.21 45 top
WS4  46.48,62.72 157.5 top
WS5  35,65 90 top
WS6  23.52,62.72 202.5 top
WS7  13.79,56.21 135 top
WS8  7.28,46.48 247.5 top
WS9  5,35 180 top
WS10  7.28,23.52 292.5 top
WS11  13.79,13.79 225 top
WS12  23.52,7.28 337.5 top
WS13  35,5 270 top
WS14  46.48,7.28 22.5 top
WS15  56.21,13.79 315 top
WS16  62.72,23.52 67.5 top

### Tracks (layer width: path | path; a pad name or v marks a point on that pad's centre or on a via)
0
  Top 0.305: T1.3 43.32,27.32 R4.1 | R4.1 44.32,27.58 48.22,27.58 U$2.P$2 | R4.1 43.32,32.57 U1.25
1.8V  (via drill 0.35)
  Top 0.152: 54.19,47.99 JP3.1 | 51.2,44 R15.2
  Top 0.2: 54,35.15 R20.2
  Top 0.305: R17.2 51.53,49 52.54,47.99 JP3.1 54,47.55 v54,47 | C9.1 C12.1
  Bottom 0.305: v54,47 v54,43
  pour Top: 49,47 57,47 58,46 58,34 56,32 50,32 47,35 47,45
3.3V  (via drill 0.35)
  Top 0.305: v60,35 59.85,34.85 | R21.2 56,45.85 56,49 54,51 | v56,28 57.19,28 57.69,28.5 JP5.2 | v60,35 59.05,34.05 U4.1 57.93,34.42 57.57,34.42 57.4,34.6 57.4,35.4 57.57,35.58 57.93,35.58 U4.3 | C5.1 v60,35
  Bottom 0.305: 64.5,35.5 J3.2 | J3.2 60.5,35.5 v60,35 | v25,21 v25,29 v29,29 | v52,25 53,25 v56,28 61,28 66,33 66,35 65.5,35.5 J3.2
  pour Top (isolate 0.2, rank 2): 35,10 arc-90 10,35 arc-90 35,60 arc-90 60,35 arc-90
!DTR
  Top 0.305: U5.13 34.37,19.16 R2.1 39.73,20.58 T1.2
!RTS  (via drill 0.35)
  Top 0.305: T2.2 34.8,23.8 | R3.1 35,23.8 34.8,23.8 | U5.14 33.09,18.91 v33,19 | v33,22 34.8,23.8
  Bottom 0.305: v33,19 v33,22
CC1
  Bottom 0.305: J2.3 36.75,7.75 38,9 38,10.65 R6.2
CC2
  Bottom 0.305: J2.9 33.75,10.9 R7.2
CHAR_LED_VIN
  Top 0.305: CHARGING.A R10.1
D+  (via drill 0.35)
  Top 0.305: U5.5 v35.63,9.94
  Bottom 0.305: v35.63,9.94 35.25,9.56 J2.6 J2.7
D-  (via drill 0.35)
  Top 0.305: U5.6 v36.91,9.94
  Bottom 0.305: v36.91,9.94 36.91,8.67 35.75,7.52 J2.5 35.75,6.13 35.51,5.89 34.49,5.89 34.25,6.13 J2.8
DI
  Top 0.305: U1.30 43.6,39 45,39 45,31 46,30 R22.2
DI_TO_WS  (via drill 0.35)
  Top 0.305: R22.1 48.85,29 v49,29 | v62,31 62,32.98 WS1.4
  Bottom 0.305: v49,29 60,29 v62,31
FSYNC  (via drill 0.35)
  Top 0.152: Q3.2 49.5,47 | v51,39 52.1,37.9 U2.11
  Top 0.305: Q3.2 48.15,48.15 R17.1 | 49.5,47 v51,47
  Bottom 0.152: v51,47 v51,39
FSYNC_VIN  (via drill 0.35)  (1 unrouted)
  Top 0.152: 43,40 43.13,40
  Top 0.305: Q3.3 47.5,46.5 | 47.5,46.5 v47,46 | v41,41 42,41 42.63,40.37 U1.31 | R19.1 46.15,47.85 47.5,46.5
  Bottom 0.305: v47,46 43,42 42,42 v41,41
GND  (via drill 0.35)  (9 unrouted)
  Top 0.2: U2.18 52,40 52,40.02 52.08,40.09 52.08,40.48 U2.20
  Top 0.203: U2.18 v54,40
  Top 0.305: AP2112K-3.3.2 14.8,29.8 14,29 11,29 10,30 C2.2 | WS11.3 18.81,16.55 C1.2 | U1.1 30.17,49.26 U1.39_3 41.5,49.26 U1.38 | U1.39_7 32.16,38.16 29.29,35.28 U1.15 | U3.2 19.55,43.55 v19.5,44 | 61.25,36.6 60.6,36.6 59,35 U4.2 | 61.25,36.6 C12.2 C9.2 58.85,41.5 C11.2 | 61.25,36.6 WS1.3 | 59.83,30.8 C5.2 | U$1.P$1 20.8,25.8 v21,26 | U$2.P$1 48.2,22.2 v48,22 | U5.1 30.55,10.55 30,10
  Bottom 0.305: C13.2 R6.1 R7.1 R13.1
  other vias: 9,41 12,50 50,57 58,49 40,9 14,19 34.5,9
  pour Bottom: 0,35 arc-90 35,70 arc-90 70,35 arc-90 35,0 arc-90
  pour Top (isolate 0.2, rank 3): 35,6 arc-90 6,35 arc-90 35,64 arc-90 64,35 arc-90
INT  (via drill 0.35)  (1 unrouted)
  Top 0.152: 52,44 v52.03,43.97 | v52,39 52,38.43 52.4,38.03 52.4,37.55 U2.12
  Top 0.203: R20.1 52.48,35.33 52.48,37.22 52.5,37.24
  Top 0.305: Q5.2 52,44
  Bottom 0.152: v52.03,43.97 52,43.94 v52,39
INT_VIN  (via drill 0.35)
  Top 0.152: R21.1 55,45 | U1.37
  Top 0.305: R21.1 Q5.3 53.4,45.6 v52,47 | v45.3,48 U1.37
  Bottom 0.152: v52,47 51.86,47 50.86,48
  Bottom 0.305: v45.3,48 50.86,48
LED1.8
  Top 0.305: JP3.2 53.94,49.51 POWER2.A
LED1.8_2
  Top 0.305: POWER2.C 50.14,53.49 R12.2
N$1
  Top 0.305: POWER.C R5.2
N$8
  Top 0.305: JP2.2 POWER.A
PROG
  Top 0.305: R11.2 12.8,36.39 14.41,38 18.65,38 U3.5
REGOUT  (via drill 0.35)
  Top 0.152: v51.7,36.4 51.7,37.1 U2.10
  Top 0.305: v56,43 C11.1
  Bottom 0.305: v51.7,36.4 53.4,36.4 56,39 v56,43
RESET
  Top 0.305: T2.3 27.17,26.05 | T2.3 27.22,30.22 28,31 28,46 27.28,46.72 U1.3 | U$1.P$2 18.47,21.73 20,21.73 | 20,21.73 R1.1 25,23.83 25,25 26,26 T2.3 | C1.1 20.51,21.22 20,21.73
RXI  (via drill 0.25, 0.35)
  Top 0.305: U5.2 31.82,13.82 34,16 43,16 v45,18 46.5,19.5 RX1.C | U1.34 44.82,44.18 45,44 v45,43
  Bottom 0.305: v45,18 v45,43
SCL  (via drill 0.35)
  Top 0.305: v52,32 51,33 Q1.3 | v52,32 49,32 47,34 47,45 45.28,46.72 U1.36 | R16.1 v52,32
  Bottom 0.203: J3.4 63.5,33.5
  Bottom 0.305: J3.4 61.5,33.5 59,31 53,31 v52,32
SCL1V8  (via drill 0.35)  (1 unrouted)
  Top 0.203: v50,42 50.91,41.09 U2.23
  Top 0.305: Q1.2 49.4,32.6 v48,34 | v50,42 49.15,42.85 R15.1
  Bottom 0.305: v48,34 48,41 49,42 v50,42
SDA  (via drill 0.35)
  Top 0.254: 56,30 50,30
  Top 0.305: Q4.3 v58,32 56,30 | U1.33 44.11,42.91 46,41.02 46,34 50,30 50,29 52,27 R14.1
  Bottom 0.305: J3.3 61.5,34.5 59,32 v58,32
SDA1V8  (via drill 0.35)
  Top 0.203: U2.24 49,40.55 v49,40.5
  Top 0.305: Q4.2 55.15,31.15 R8.1 52.15,33 v52,33
  Bottom 0.305: v52,33 49,36 v49,40.5
SDA_W_1
  Top 0.305: JP5.1 57.58,27 R14.2
SDA_W_2
  Top 0.305: JP5.3 57.81,29.52 57.44,29.15 R16.2
STAT
  Top 0.305: CHARGING.C 20.5,44.37 U3.1
TO_RX_LED
  Top 0.305: RX1.A 51.5,19.5 53.5,21.5 R9.2
TO_T1
  Top 0.305: R3.2 T1.1
TO_T2
  Top 0.305: R2.2 27.42,20.58 26.27,21.73 T2.1
TO_TX_LED
  Top 0.305: R18.2 51.65,17.5 TX1.A
TX_RX_LED_SUPPLY
  Top 0.305: R18.1 R9.1 55.35,23.84 JP4.2
TXO  (via drill 0.25, 0.35)
  Top 0.305: U5.3 33.09,14.1 34,15 43,15 v46,18 48,18 48.5,17.5 TX1.C | U1.35 44.55,45.45 46,44 v46,43
  Bottom 0.305: v46,43 v46,18
V3_CH340
  Top 0.305: U5.4 34.37,13.37 35,14 45.88,14 C4.1
V_BATT  (via drill 0.35)
  Top 0.305: v32,60 31.58,59.58 C8.1 30.18,59.18 29,58 23,58 18.6,53.6 18.6,48 | U3.3 18.6,48 | Q2.3 21.92,45.08 19,48 18.6,48
  Bottom 0.305: JP1.2 33.7,61.7 v32,60
V_USB  (via drill 0.35)
  Top 0.305: U3.4 18,39.25 v18,38.68 16.1,40.58 13.99,40.58 C7.1 11.99,43.47 R10.2 14,45.3 | D1.A 17.35,35.65 v18,35 18.45,35.45 Q2.1
  Bottom 0.305: v18,38.68 v18,35 24,29 24,17 27.5,13.5 | J2.11 32.65,9.35 32,10 R13.2 29.35,11.65 27.5,13.5 | J2.2 37.35,7.35 39,9 39,11.15 C13.1 39.65,11.65 41,13 41,14 40,15 29,15 27.5,13.5
VIN
  Top 0.305: AP2112K-3.3.3 17.74,28.85 18.11,29.21 18.11,30.39 17.74,30.75 AP2112K-3.3.1 17.2,30.93 Q2.2 19.62,33.35 D1.C 12.89,30.5 C2.1 10.2,32 6,32 2.42,35.58 WS9.1
  pour Top (rank 5): 70,35 arc-90 35,0 arc-90 0,35 arc-90 35,70 arc-90
WS1_2
  Top 0.305: WS2.4 WS1.2
WS2_3
  Top 0.305: WS2.2 WS3.4
WS3_4
  Top 0.305: WS4.4 WS3.2
WS4_5
  Top 0.305: WS5.4 WS4.2
WS5_6
  Top 0.305: WS6.4 WS5.2
WS6_7
  Top 0.305: WS7.4 WS6.2
WS7_8
  Top 0.305: WS8.4 WS7.2
WS8_9
  Top 0.2: 7.58,43.01 arc-45 WS8.2
  Top 0.305: WS9.4 WS8.2
WS9_10
  Top 0.305: WS10.4 WS9.2
WS10_11
  Top 0.2: 9.95,21.27 arc-45 WS10.2
  Top 0.305: WS11.4 WS10.2
WS11_12
  Top 0.305: WS12.4 WS11.2
WS12_13
  Top 0.305: WS12.2 29.43,7.78 29.91,8.26 32.72,8.26 WS13.4
WS13_14
  Top 0.305: WS13.2 38.18,4 39.7,4 43.89,4 WS14.4
WS14_15
  Top 0.2: 52.78,14.28 arc-45 WS15.4
  Top 0.305: WS14.2 WS15.4
WS15_16
  Top 0.305: WS16.4 WS15.2